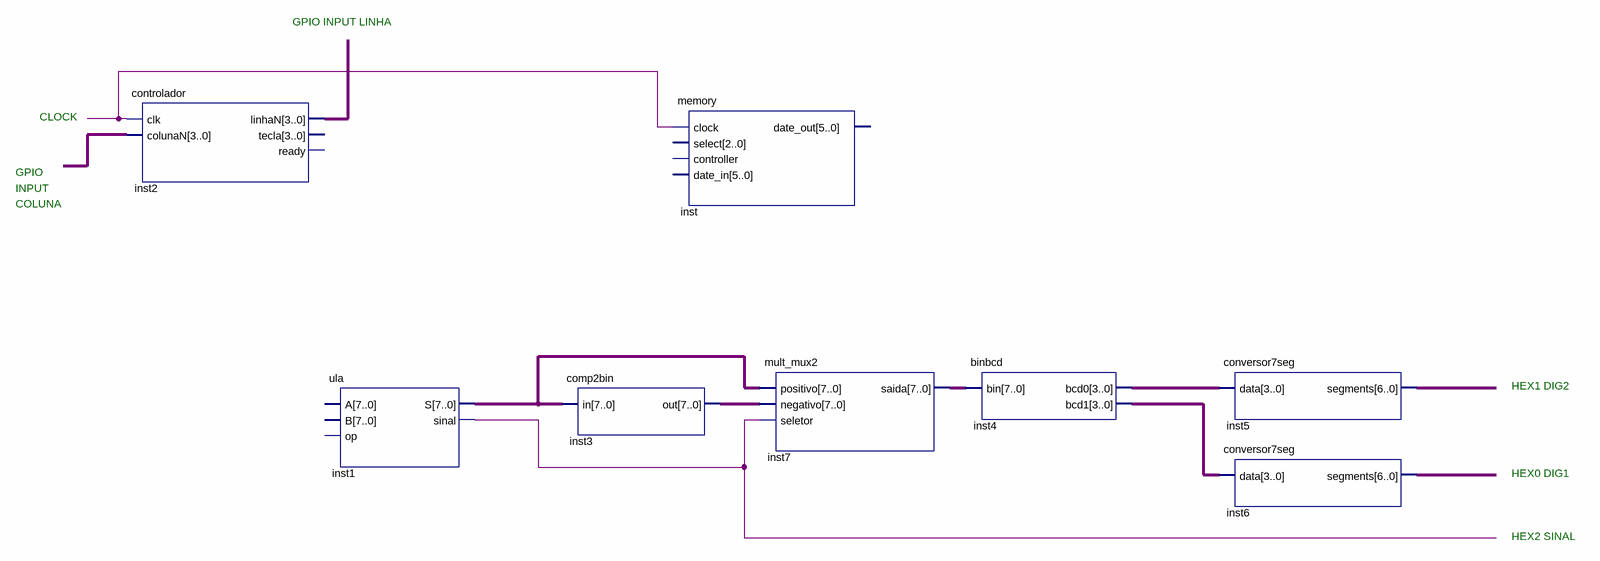
[diagram p0: schematic sheet]
// Quartus schematic main.bdf as structural Verilog: 8 symbols, 0 pins
module main (
);

  wire inst1_sinal, undriven_2;
  wire [3:0] inst2_linhan, inst4_bcd0, inst4_bcd1, undriven;
  wire [6:0] inst5_segments, inst6_segments;
  wire [7:0] inst1_s, inst3_out, inst7_saida;

  controlador inst2 (.clk(undriven_2), .colunaN(undriven), .linhaN(inst2_linhan));  // open: tecla, ready
  ula inst1 (.S(inst1_s), .sinal(inst1_sinal));  // open: A, B, op
  comp2bin inst3 (.in(inst1_s), .out(inst3_out));
  memory inst (.clock(undriven_2));  // open: select, controller, date_in, date_out
  mult_mux2 inst7 (.positivo(inst1_s), .negativo(inst3_out), .seletor(inst1_sinal), .saida(inst7_saida));
  binbcd inst4 (.bin(inst7_saida), .bcd0(inst4_bcd0), .bcd1(inst4_bcd1));
  conversor7seg inst5 (.data(inst4_bcd0), .segments(inst5_segments));
  conversor7seg inst6 (.data(inst4_bcd1), .segments(inst6_segments));

  // Notes on the sheet:
  //   GPIO INPUT LINHA  
  //   CLOCK
  //   GPIO 
  //   INPUT 
  //   COLUNA 
  //   HEX1 DIG2 
  //   HEX0 DIG1 
  //   HEX2 SINAL 
endmodule
